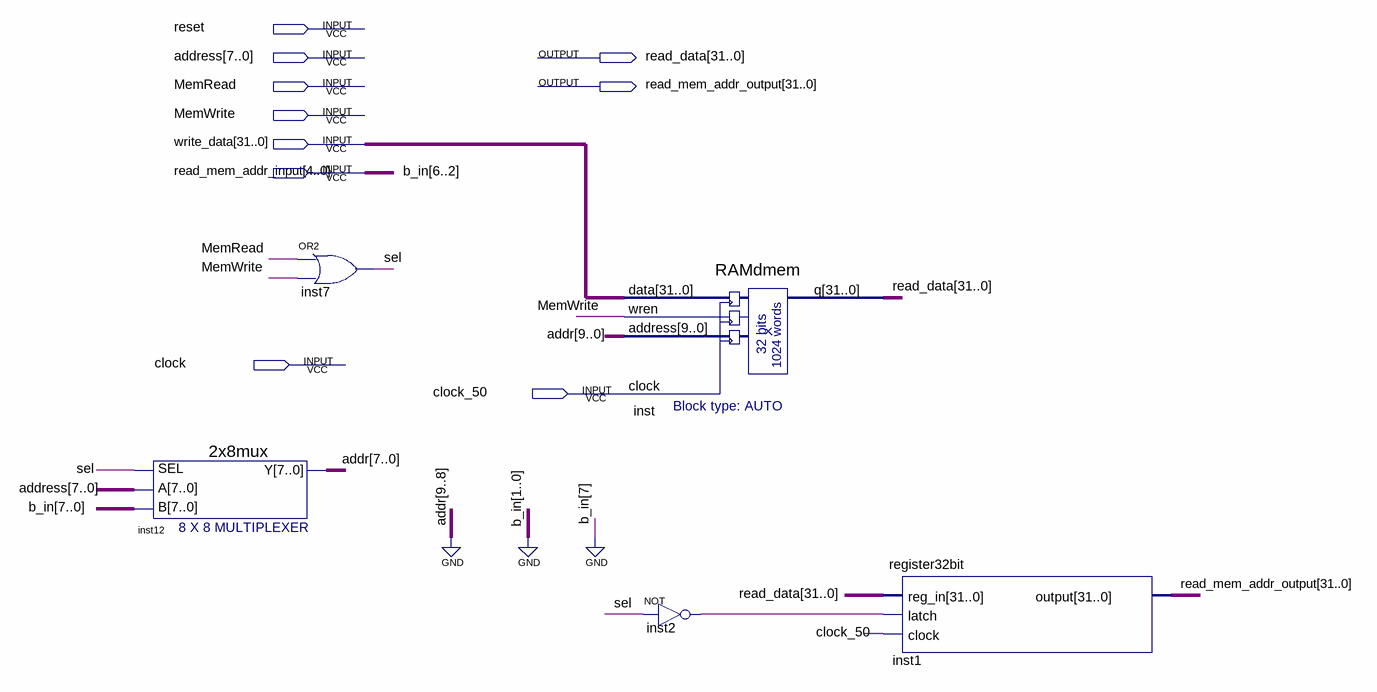
[diagram p0: schematic sheet]
// Quartus schematic dmem.bdf as structural Verilog: 5 symbols, 10 pins
module dmem (
  input  reset,
  input  [7:0] address,
  input  MemRead,
  input  MemWrite,
  input  [31:0] write_data,
  input  [4:0] read_mem_addr_input,
  input  clock,
  input  clock_50,
  output [31:0] read_data,
  output [31:0] read_mem_addr_output
);

  wire inst2_out, sel;
  wire [7:0] addr;

  \2x8mux  inst12 (.SEL(sel), .A(address), .B({1'b0, read_mem_addr_input, 2'b00}), .Y(addr));
  or inst7 (sel, MemRead, MemWrite);
  RAMdmem inst (.data(write_data), .wren(MemWrite), .address({2'b00, addr}), .clock(clock_50), .q(read_data));
  not inst2 (inst2_out, sel);
  register32bit inst1 (.reg_in(read_data), .latch(inst2_out), .clock(clock_50), .\output (read_mem_addr_output));

  // Other names for the same wires on the sheet: b_in[6:2] = read_mem_addr_input
endmodule
